# Altium schematic sheet MCU.SchDoc
size A3; Author: Ali Zoubir; Organization: ETML-ES; Address1: Avenue Recordon 1; Address2: 1004 Lausanne; Address3: Switzerland; Revision: 1924B; SheetNumber: 2; SheetTotal: 4; SPICEModelCacheGNAZWADN: <root> / <DocumentId>GNAZWADN</DocumentId> / </root>; Version: V0
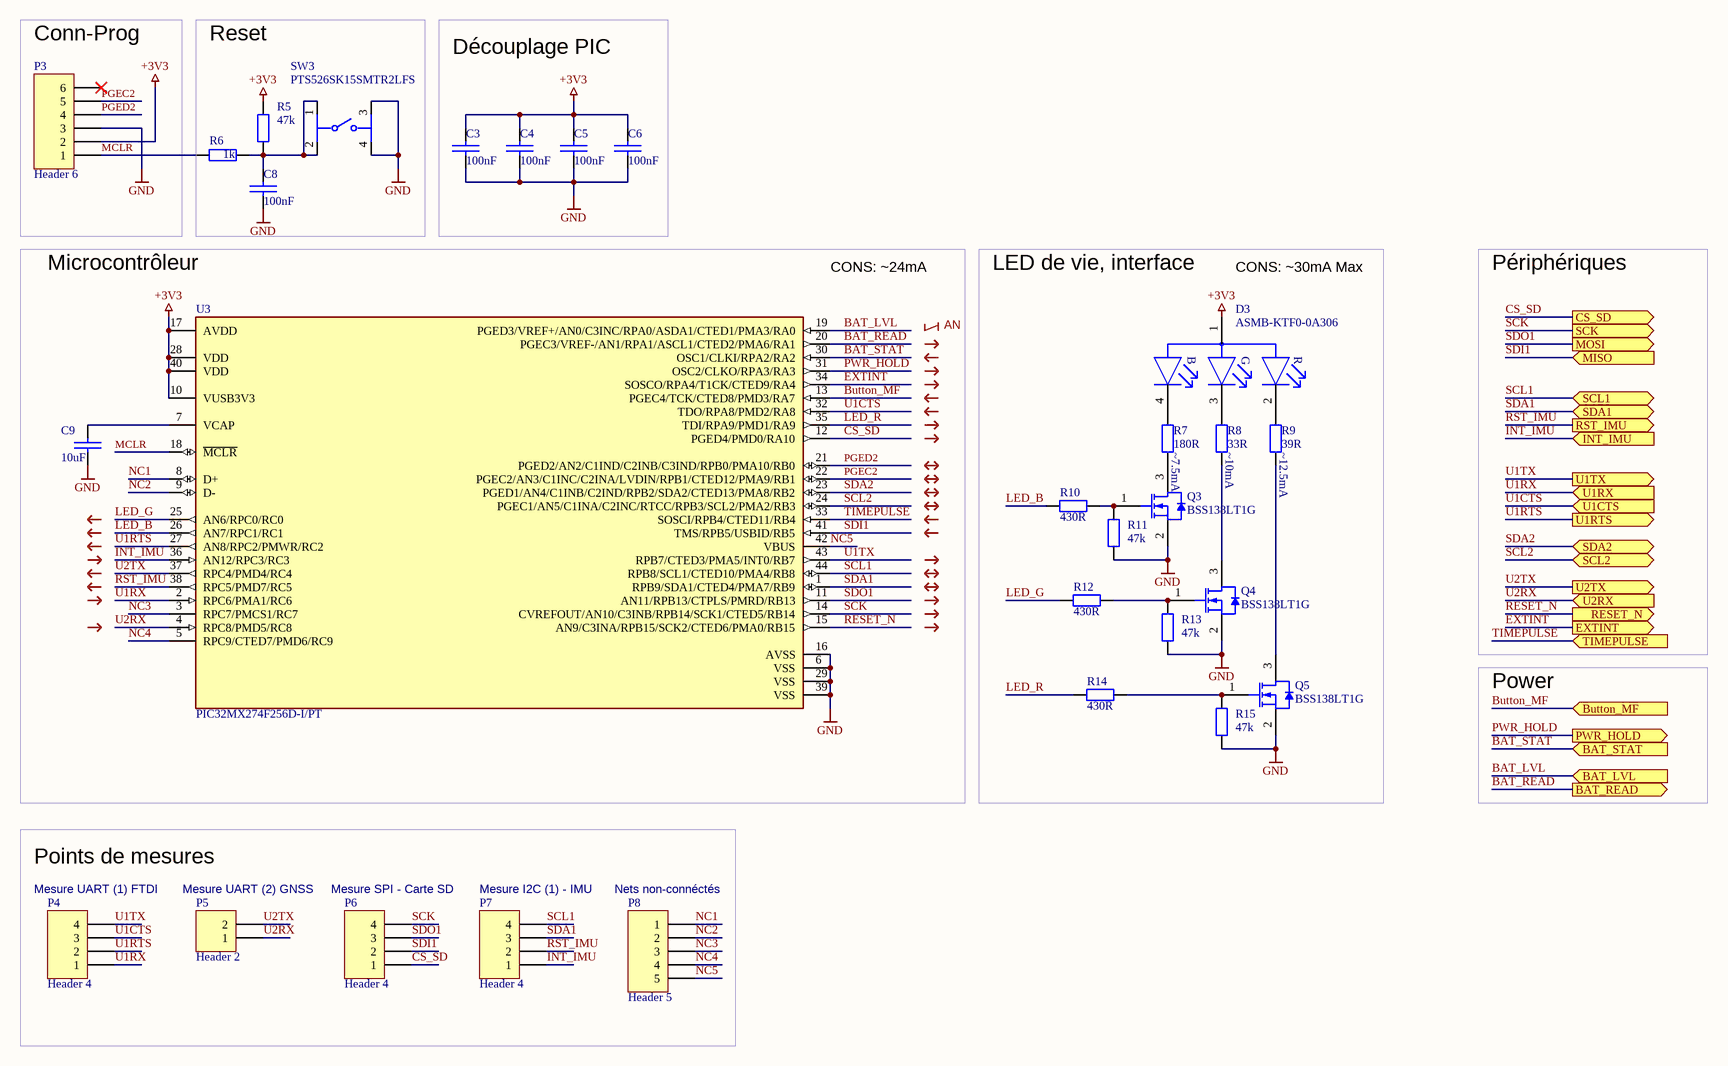
[diagram p0: MCU.SchDoc]

## Parts
C3  100nF  [Cap_0805]
C4  100nF  [Cap_0805]
C5  100nF  [Cap_0805]
C6  100nF  [Cap_0805]
C8  100nF  [Cap_0805]
C9  10uF  [Cap_0805]
D3  ASMB-KTF0-0A306  [FP-PLCC-4-MFG]
P3  Header 6  [HDR1X6]
P4  Header 4  [HDR1X4]
P5  Header 2  [HDR1X2]
P6  Header 4  [HDR1X4]
P7  Header 4  [HDR1X4]
P8  Header 5  [HDR1X5]
Q3  BSS138LT1G  [ONSC-SOT-23-3-318-08_V]
Q4  BSS138LT1G  [ONSC-SOT-23-3-318-08_V]
Q5  BSS138LT1G  [ONSC-SOT-23-3-318-08_V]
R5  47k  [RES_0805]
R6  1k  [RES_0805]
R7  value 180R  [RES_0805]  (hidden comment: 430R)
R8  value 33R  [RES_0805]  (hidden comment: 430R)
R9  value 39R  [RES_0805]  (hidden comment: 430R)
R10  430R  [RES_0805]
R11  value 47k  [RES_0805]  (hidden comment: 10k)
R12  430R  [RES_0805]
R13  value 47k  [RES_0805]  (hidden comment: 10k)
R14  430R  [RES_0805]
R15  value 47k  [RES_0805]  (hidden comment: 10k)
SW3  PTS526SK15SMTR2LFS  [FP-PTS526SK15SMTR2LFS-MFG]
U3  PIC32MX274F256D-I/PT  [FP-C04-076-IPC_A]

## Blocks framed on the sheet
Conn-Prog: P3
Reset: C8 R5 R6 SW3
Découplage PIC: C3-C6
Microcontrôleur: C9 U3
LED de vie, interface: D3 Q3-Q5 R7-R15
Points de mesures: P4-P8

## Ports
BAT_LVL (in), BAT_READ (out), BAT_STAT (in), Button_MF (in), CS_SD (out), EXTINT (out), INT_IMU (in), MISO (in), MOSI (out), PWR_HOLD (out), RESET_N (out), RST_IMU (out), SCK (out), SCL1 (bidir), SCL2 (bidir), SDA1 (bidir), SDA2 (bidir), TIMEPULSE (in), U1CTS (in), U1RTS (out), U1RX (in), U1TX (out), U2RX (in), U2TX (out)

## Nets
+3V3: C3.1 C4.1 C5.1 C6.1 D3.1(A) P3.2 R5.1 U3.10(VUSB3V3) U3.17(AVDD) U3.28(VDD) U3.40(VDD)
GND: C3.2 C4.2 C5.2 C6.2 C8.2 C9.2 P3.3 Q3.2(S) Q4.2(S) Q5.2(S) R11.1 R13.1 R15.1 SW3.3 SW3.4 U3.6(VSS) U3.16(AVSS) U3.29(VSS) U3.39(VSS)
BAT_LVL: U3.19(PGED3/VREF+/AN0/C3INC/RPA0/ASDA1/CTED1/PMA3/RA0) ; port BAT_LVL
BAT_READ: U3.20(PGEC3/VREF-/AN1/RPA1/ASCL1/CTED2/PMA6/RA1) ; port BAT_READ
BAT_STAT: U3.30(OSC1/CLKI/RPA2/RA2) ; port BAT_STAT
Button_MF: U3.13(PGEC4/TCK/CTED8/PMD3/RA7) ; port Button_MF
CS_SD: P6.1 U3.12(PGED4/PMD0/RA10) ; port CS_SD
EXTINT: U3.34(SOSCO/RPA4/T1CK/CTED9/RA4) ; port EXTINT
INT_IMU: P7.1 U3.36(AN12/RPC3/RC3) ; port INT_IMU
LED_B: R10.2 U3.26(AN7/RPC1/RC1)
LED_G: R12.2 U3.25(AN6/RPC0/RC0)
LED_R: R14.2 U3.35(TDI/RPA9/PMD1/RA9)
MCLR: P3.1 R6.1 U3.18(~{MCLR})
NC1: P8.1 U3.8(D+)
NC2: P8.2 U3.9(D-)
NC3: P8.3 U3.3(RPC7/PMCS1/RC7)
NC4: P8.4 U3.5(RPC9/CTED7/PMD6/RC9)
NC5: P8.5 U3.42(VBUS)
PGEC2: P3.5 U3.22(PGEC2/AN3/C1INC/C2INA/LVDIN/RPB1/CTED12/PMA9/RB1)
PGED2: P3.4 U3.21(PGED2/AN2/C1IND/C2INB/C3IND/RPB0/PMA10/RB0)
PWR_HOLD: U3.31(OSC2/CLKO/RPA3/RA3) ; port PWR_HOLD
RESET_N: U3.15(AN9/C3INA/RPB15/SCK2/CTED6/PMA0/RB15) ; port RESET_N
RST_IMU: P7.2 U3.38(RPC5/PMD7/RC5) ; port RST_IMU
SCK: P6.4 U3.14(CVREFOUT/AN10/C3INB/RPB14/SCK1/CTED5/RB14) ; port SCK
SCL1: P7.4 U3.44(RPB8/SCL1/CTED10/PMA4/RB8) ; port SCL1
SCL2: U3.24(PGEC1/AN5/C1INA/C2INC/RTCC/RPB3/SCL2/PMA2/RB3) ; port SCL2
SDA1: P7.3 U3.1(RPB9/SDA1/CTED4/PMA7/RB9) ; port SDA1
SDA2: U3.23(PGED1/AN4/C1INB/C2IND/RPB2/SDA2/CTED13/PMA8/RB2) ; port SDA2
SDI1: P6.2 U3.41(TMS/RPB5/USBID/RB5) ; port MISO
SDO1: P6.3 U3.11(AN11/RPB13/CTPLS/PMRD/RB13) ; port MOSI
TIMEPULSE: U3.33(SOSCI/RPB4/CTED11/RB4) ; port TIMEPULSE
U1CTS: P4.3 U3.32(TDO/RPA8/PMD2/RA8) ; port U1CTS
U1RTS: P4.2 U3.27(AN8/RPC2/PMWR/RC2) ; port U1RTS
U1RX: P4.1 U3.2(RPC6/PMA1/RC6) ; port U1RX
U1TX: P4.4 U3.43(RPB7/CTED3/PMA5/INT0/RB7) ; port U1TX
U2RX: P5.1 U3.4(RPC8/PMD5/RC8) ; port U2RX
U2TX: P5.2 U3.37(RPC4/PMD4/RC4) ; port U2TX
NetC8_1: C8.1 R5.2 R6.2 SW3.1 SW3.2
NetC9_1: C9.1 U3.7(VCAP)
NetD3_2: D3.2(Red_C) R9.1
NetD3_3: D3.3(Green_C) R8.1
NetD3_4: D3.4(Blue_C) R7.1
NetQ3_1: Q3.1(G) R10.1 R11.2
NetQ3_3: Q3.3(D) R7.2
NetQ4_1: Q4.1(G) R12.1 R13.2
NetQ4_3: Q4.3(D) R8.2
NetQ5_1: Q5.1(G) R14.1 R15.2
NetQ5_3: Q5.3(D) R9.2

Not connected (* = marked no-connect by the designer): P3 6*

## Notes on the sheet
- CONS: ~24mA
- CONS: ~30mA Max
- Périphériques
- AN
- ~7.5mA
- (near R8) ~10mA
- (near R9) ~12.5mA
- Power
- (near P4) Mesure UART (1) FTDI
- (near P5) Mesure UART (2) GNSS
- (near P6) Mesure SPI - Carte SD
- (near P7) Mesure I2C (1) - IMU
- (near P8) Nets non-connéctés
- Fichier :
- a
- Date :
- Heure :
- Version :
- Auteur :
- Modif.
- b
- c
- d
- Projet :
- No :
- Nb feuilles
- Feuille n°
- Chemin :
- (in symbol CMP-18399-000003-1) B; G; R

## Library data of the parts
C3-C6 C8 C9 = C: SDTSourceLibName: C:\WINDOWS\TEMP\DA.LIB; PCB Footprint: RC0805
D3 = CMP-18399-000003-1: LED RGB 4PLCC SMD; Manufacturer: Broadcom; Peak Emmision Wavelength: 467/518/628nm; Luminous Intensity: 215/1100/490mcd; Power Dissipation: 66/66/48mW; Led Orientation: Top View; Colour: Blue, Green, Red; Wavelength: 471/524/620nm; Forward Current: 10/15/15mA; Reverse Voltage: 4V; Viewing Angle: 110°; Forward Voltage: 2.85/2.95/2V; Max Junction Temp: +100°C; Digikey Description: LED RGB 4PLCC SMD; ComponentLink2URL: https://docs.broadcom.com/docs/ASMB-KTF0-0A306-DS100; ComponentLink2Description: Datasheet; Manufacturer Part Number: ASMB-KTF0-0A306; Temperature Range Low: -40°C; Device Class L2: LEDs; RoHS: TRUE; Octopart: https://octopart.com/asmb-ktf0-0a306-broadcom-87157377; Package: PLCC-4; Mouser Description: LED Multi-Color Chip Red/Green/Blue 620nm/524nm/471nm 20mA 4-Pin PLCC T/R; Category: Diode; Lead Free: Yes; Height: 2.1mm; Temperature: -40°C to +85°C; Device Class L1: Optoelectronics; Automotive: No; Temperature Range High: +85°C; Device Class L3: unset
P3 = Header 6: Header, 6-Pin; LatestRevisionDate: 17-Jul-2002; LatestRevisionNote: Re-released for DXP Platform.; Publisher: Altium Limited
P4 P6 P7 = Header 4: Header, 4-Pin; LatestRevisionDate: 17-Jul-2002; LatestRevisionNote: Re-released for DXP Platform.; Publisher: Altium Limited
P5 = Header 2: Header, 2-Pin; LatestRevisionDate: 17-Jul-2002; LatestRevisionNote: Re-released for DXP Platform.; Publisher: Altium Limited
P8 = Header 5: Header, 5-Pin; LatestRevisionDate: 17-Jul-2002; LatestRevisionNote: Re-released for DXP Platform.; Publisher: Altium Limited
Q3-Q5 = CMP-1058-00767-1: Power MOSFET, 200 mA, 50 V, N-Channel, 3-Pin SOT-23, Pb-Free, Tape and Reel; Manufacturer: On Semiconductor; PD Max (W): 0.225; Coss Typ (pF): 12; V(BR)DSS Min (V): 50; VGS Max (V): 20; Channel Polarity: N Channel; Configuration: Single; VGS(th) Max (V): 1.5; Ciss Typ (pF): 40; Crss Typ (pF): 3.5; ID Max (A): 0.2; ComponentLink3Description: Package Specification; PackageDescription: 3-Pin Small Outline Transistor, Body 2.92 x 1.3 mm, Pitch 0.95 mm; PackageReference: SOT-23-3-318-08; RoHS: Pb-Free; Mounting Technology: Surface Mount; ComponentLink1Description: Manufacturer URL; ComponentLink2URL: http://www.onsemi.com/pub_link/Collateral/BSS138LT1-D.PDF; ComponentLink2Description: Datasheet; Packing: Tape and Reel; PackageVersion: Rev. AP, 11/2009; PartNumber: BSS138LT1G; Package Type: SOT-23-3; ComponentLink1URL: http://www.onsemi.com/; DatasheetVersion: Rev. 8; ComponentLink3URL: http://www.onsemi.cn/pub_link/Collateral/318-08.PDF
R5 = Res2: Res 0805; Value: 1K; Published: 8-Jun-2000; LatestRevisionDate: 17-Jul-2002; LatestRevisionNote: Re-released for DXP Platform.; PackageReference: AXIAL-0.4; Publisher: Altium Limited; PackageDescription: Axial Device, Thru-Hole; 2 Leads; 0.4 in Pin Spacing
R6-R15 = Res2: Res 0805; Published: 8-Jun-2000; LatestRevisionDate: 17-Jul-2002; LatestRevisionNote: Re-released for DXP Platform.; PackageReference: AXIAL-0.4; Publisher: Altium Limited; PackageDescription: Axial Device, Thru-Hole; 2 Leads; 0.4 in Pin Spacing
  R6: Value: 1K
  R10 R12 R14: Value: 430R
SW3 = CMP-10040-000013-1: TACT 5.2 X 5.2, 1.5 MM H, 260GF,; Manufacturer: C&K; Operating Force: 250gf; Throw Configuration: SPST-NO; Contact Current Rating: 50mA; Standoff Height: 0mm; Contact Resistance: 100mΩ; Voltage Rating Dc: 12V; Electromechanical Life: 200000Cycles; Device Class L3: Tactile Switches; Device Class L2: Switches; Temperature: -20°C to +70°C; Temperature Range Low: -20°C; Package: PTS526SK15SMTR2LFS; Temperature Range High: +70°C; ComponentLink2Description: Datasheet; Device Class L1: Electromechanical; Height: 1.65mm; Digikey Description: TACT 5.2 X 5.2, 1.5 MM H, 260GF,; Category: Switch; RoHS: TRUE; Automotive: No; Lead Free: Yes; Manufacturer Part Number: PTS526SK15SMTR2LFS; Octopart: https://octopart.com/pts526+sk15+smtr2+lfs-c%26k+components-100617999; ComponentLink2URL: https://www.ckswitches.com/media/2780/pts526.pdf
U3 = CMP-06276-000357-1: IC MCU 32BIT 256KB FLASH 44TQFP